# Altium schematic sheet Thermistor.SchDoc
size 209 x 297 mm; Address1: Address1; Address2: Address2; Address3: Address3; Address4: Address4; DocumentNumber: *Э3; SheetNumber: 12; SheetTotal: 12; DocumentType: Схема электрическая *
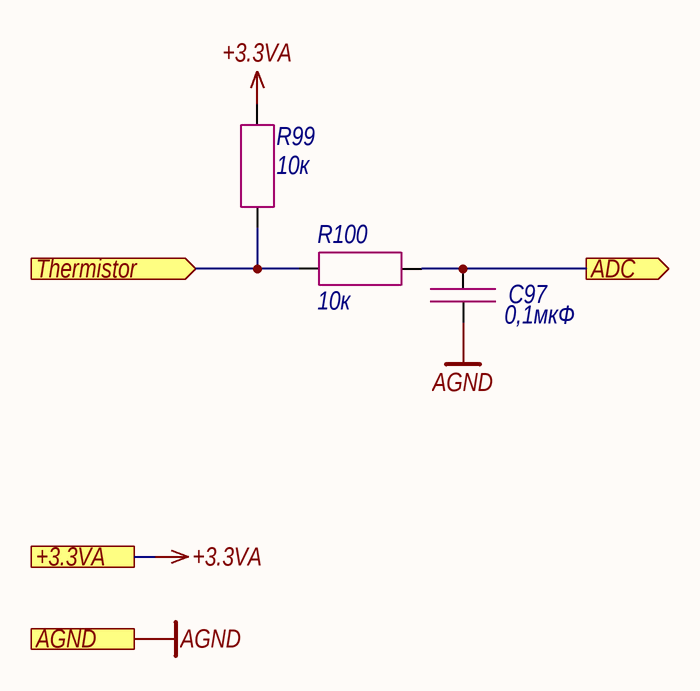
[diagram p0: Thermistor.SchDoc]

## Parts
C97  0,1мкФ  [CAP_0603]
R99  10к  [RES_0603]
R100  10к  [RES_0603]

## Ports
+3.3VA (see Main[2C], Hardwiring[4D]), ADC (out, see Main[3C]), AGND (see Main[2C], Hardwiring[4D], Photodiode[1C]), Thermistor (in, see Main[2C])

## Nets
+3.3VA: R99.1 ; port +3.3VA
AGND: C97.2 ; port AGND
ADC: C97.1 R100.2 ; port ADC
Thermistor: R99.2 R100.1 ; port Thermistor

## Notes on the sheet
- Подп. и дата
- Инв. № дубл.
- Взам. инв. №
- Инв. № подл.
- Изм.
- Лист
- № докум.
- Подп.
- Дата
- Копировал
- Формат А4

## Library data of the parts
C97 = Capacitor: Manufacturer: Murata; Model: GRM188R71H104KA93D; Value: 0,1мкФ; Document: *
R99 R100 = Resistor: Manufacturer: Yageo; Model: RC0603FR-0710KL; Value: 10к; Document: *